# EAGLE design stm32uni (EAGLE 6.1)
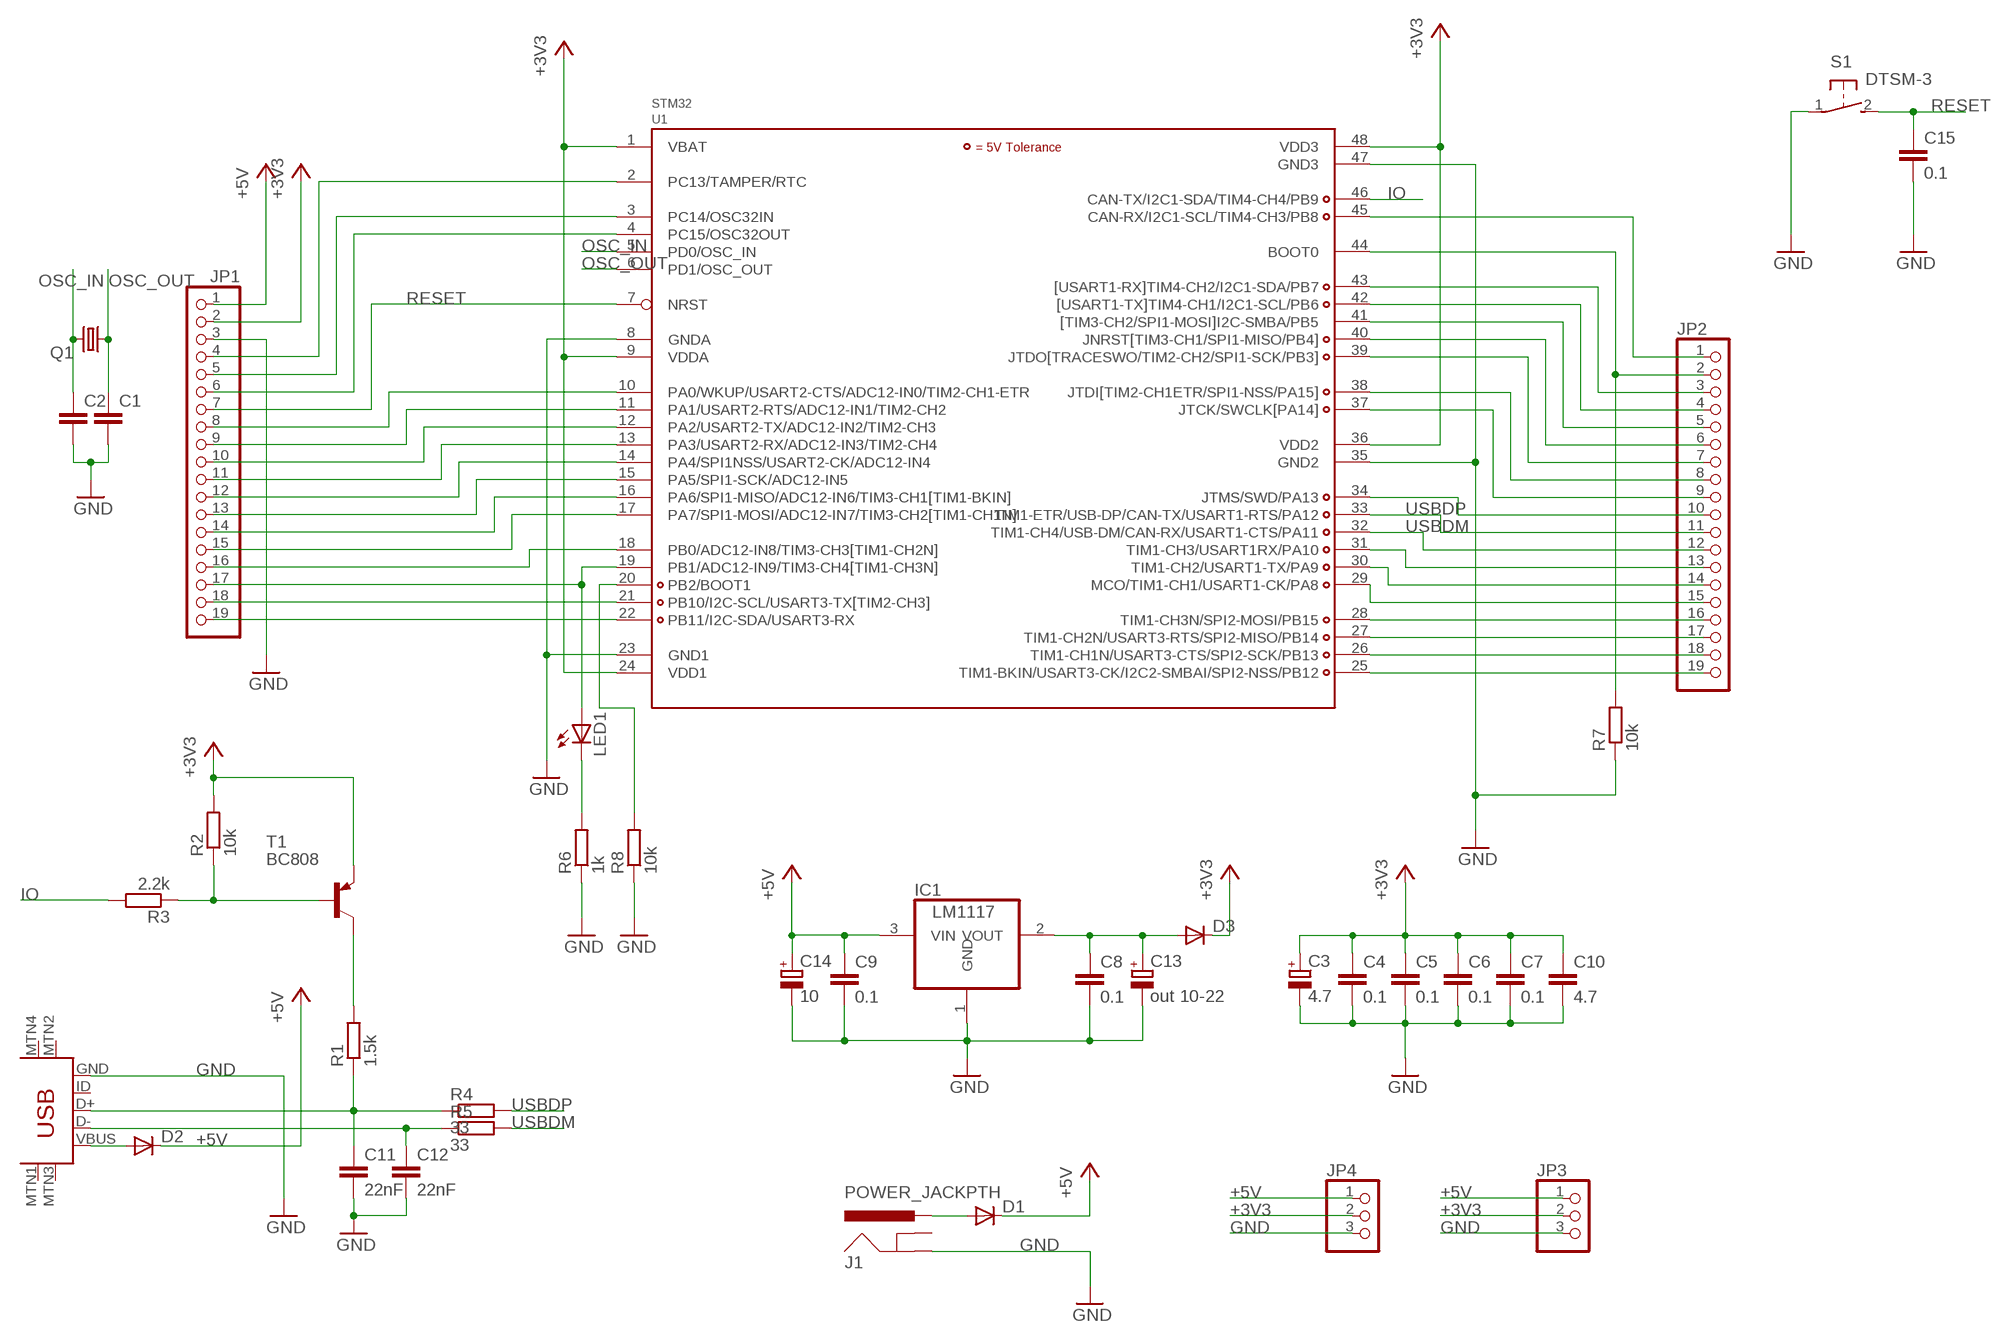
[diagram p0: schematic, sheet 1]

## Parts
C1  C-EUC0805  [C0805]
C2  C-EUC0805  [C0805]
C3  4.7  CPOL-EUSMCB  [SMC_B]
C4  0.1  C-EUC0805  [C0805]
C5  0.1  C-EUC0805  [C0805]
C6  0.1  C-EUC0805  [C0805]
C7  0.1  C-EUC0805  [C0805]
C8  0.1  C-EUC0805  [C0805]
C9  0.1  C-EUC0805  [C0805]
C10  4.7  C-EUC0805  [C0805]
C11  22nF  C-EUC0805  [C0805]
C12  22nF  C-EUC0805  [C0805]
C13  out 10-22  CPOL-EUSMCB  [SMC_B]
C14  10  CPOL-EUSMCB  [SMC_B]
C15  0.1  C-EUC0805  [C0805]
D1  DIODE-SOD123  [SOD123]
D2  DIODE-SOD123  [SOD123]
D3  DIODE-SOD123  [SOD123]
IC1  LM1117  REG1117  [SOT223]
J1  POWER_JACKPTH  [POWER_JACK_PTH]
JP1  PINHD-1X19  [1X19]
JP2  PINHD-1X19  [1X19]
JP3  PINHD-1X3  [1X03]
JP4  PINHD-1X3  [1X03]
LED1  LEDCHIPLED_0805  [CHIPLED_0805]
Q1  CRYSTALHC49UP  [HC49UP]
R1  1.5k  R-EU_R0805  [R0805]
R2  10k  R-EU_R0805  [R0805]
R3  2.2k  R-EU_R0805  [R0805]
R4  33  R-EU_R0805  [R0805]
R5  33  R-EU_R0805  [R0805]
R6  1k  R-EU_R0805  [R0805]
R7  10k  R-EU_R0805  [R0805]
R8  10k  R-EU_R0805  [R0805]
S1  DTSM-3  [DTSM-3]
T1  BC808  BC808-16-PNP-SOT23-BEC  [SOT23-BEC]
U1  STM32  STM32F103C8LQFP48  [LQFP48]
U$1  USB-MINIB-5PIN  [USB-MINIB]

## Nets
+3V3: C3.+ C4.1 C5.1 C6.1 C7.1 C10.1 D3.C JP1.2 JP3.2 JP4.2 R2.2 T1.E U1.1(VBAT) U1.9(VDDA) U1.24(VDD1) U1.36(VDD2) U1.48(VDD3)
+5V: C9.1 C14.+ D1.C D2.C IC1.3(VIN) JP1.1 JP3.1 JP4.1
GND: C1.2 C2.2 C3.- C4.2 C5.2 C6.2 C7.2 C8.2 C9.2 C10.2 C11.2 C12.2 C13.- C14.- C15.2 IC1.1(GND) J1.GND JP1.3 JP3.3 JP4.3 R6.1 R7.1 R8.1 S1.1 U1.8(GNDA) U1.23(GND1) U1.35(GND2) U1.47(GND3) U$1.GND
IO: R3.2 U1.46(CAN-TX/I2C1-SDA/TIM4-CH4/PB9)
N$1: D2.A U$1.VBUS
N$2: D1.A J1.PWR
N$3: C8.1 C13.+ D3.A IC1.2(VOUT)
N$4: JP1.16 U1.18(PB0/ADC12-IN8/TIM3-CH3[TIM1-CH2N])
N$5: JP1.15 U1.17(PA7/SPI1-MOSI/ADC12-IN7/TIM3-CH2[TIM1-CH1N])
N$6: C11.1 R1.1 R4.1 U$1.D+
N$7: C12.1 R5.1 U$1.D-
N$8: R1.2 T1.C
N$9: R2.1 R3.1 T1.B
N$10: JP2.19 U1.25(TIM1-BKIN/USART3-CK/I2C2-SMBAI/SPI2-NSS/PB12)
N$11: JP2.18 U1.26(TIM1-CH1N/USART3-CTS/SPI2-SCK/PB13)
N$12: JP2.17 U1.27(TIM1-CH2N/USART3-RTS/SPI2-MISO/PB14)
N$13: JP2.16 U1.28(TIM1-CH3N/SPI2-MOSI/PB15)
N$14: JP2.15 U1.29(MCO/TIM1-CH1/USART1-CK/PA8)
N$15: JP2.14 U1.30(TIM1-CH2/USART1-TX/PA9)
N$16: JP2.13 U1.31(TIM1-CH3/USART1RX/PA10)
N$17: JP2.10 U1.34(JTMS/SWD/PA13)
N$18: JP2.9 U1.37(JTCK/SWCLK[PA14])
N$19: JP2.8 U1.38(JTDI[TIM2-CH1ETR/SPI1-NSS/PA15])
N$20: JP2.7 U1.39(JTDO[TRACESWO/TIM2-CH2/SPI1-SCK/PB3])
N$21: JP2.6 U1.40(JNRST[TIM3-CH1/SPI1-MISO/PB4])
N$22: JP2.5 U1.41([TIM3-CH2/SPI1-MOSI]I2C-SMBA/PB5)
N$23: JP2.4 U1.42([USART1-TX]TIM4-CH1/I2C1-SCL/PB6)
N$24: JP2.3 U1.43([USART1-RX]TIM4-CH2/I2C1-SDA/PB7)
N$25: JP2.2 R7.2 U1.44(BOOT0)
N$26: JP2.1 U1.45(CAN-RX/I2C1-SCL/TIM4-CH3/PB8)
N$27: JP1.19 U1.22(PB11/I2C-SDA/USART3-RX)
N$28: JP1.18 U1.21(PB10/I2C-SCL/USART3-TX[TIM2-CH3])
N$29: R8.2 U1.20(PB2/BOOT1)
N$30: JP1.14 U1.16(PA6/SPI1-MISO/ADC12-IN6/TIM3-CH1[TIM1-BKIN])
N$31: JP1.13 U1.15(PA5/SPI1-SCK/ADC12-IN5)
N$32: JP1.12 U1.14(PA4/SPI1NSS/USART2-CK/ADC12-IN4)
N$33: JP1.11 U1.13(PA3/USART2-RX/ADC12-IN3/TIM2-CH4)
N$34: JP1.10 U1.12(PA2/USART2-TX/ADC12-IN2/TIM2-CH3)
N$35: JP1.9 U1.11(PA1/USART2-RTS/ADC12-IN1/TIM2-CH2)
N$36: JP1.8 U1.10(PA0/WKUP/USART2-CTS/ADC12-IN0/TIM2-CH1-ETR)
N$38: JP1.6 U1.4(PC15/OSC32OUT)
N$39: JP1.5 U1.3(PC14/OSC32IN)
N$40: JP1.4 U1.2(PC13/TAMPER/RTC)
N$41: JP1.17 LED1.A U1.19(PB1/ADC12-IN9/TIM3-CH4[TIM1-CH3N])
N$42: LED1.C R6.2
OSC_IN: C2.1 Q1.2 U1.5(PD0/OSC_IN)
OSC_OUT: C1.1 Q1.1 U1.6(PD1/OSC_OUT)
RESET: C15.1 JP1.7 S1.2 U1.7(NRST)
USBDM: JP2.12 R5.2 U1.32(TIM1-CH4/USB-DM/CAN-RX/USART1-CTS/PA11)
USBDP: JP2.11 R4.2 U1.33(TIM1-ETR/USB-DP/CAN-TX/USART1-RTS/PA12)
Unconnected: J1.GNDBREAK U$1.ID U$1.MTN1(MTN2) U$1.MTN2(MTN3) U$1.MTN3(MTN1) U$1.MTN4

## Library data of the parts
C1 C2 C4-C12 C15 = rcl:C-EU: CAPACITOR, European symbol
C3 C13 C14 = rcl:CPOL-EU: POLARIZED CAPACITOR, European symbol
D1-D3 = diode:DIODE-: DIODE
IC1 = burr-brown:REG1117: 800mA and 1A Low Dropout (LDO) Positive Regulator 1.8V, 2.5V, 2.85V, 3.3V, 5V, and Adj; MPN: REG1117; OC_FARNELL: 1097566; OC_NEWARK: 14P6981
J1 = SparkFun:POWER_JACK: Power Jack This is the standard 5.5mm barrel jack for power. The PTH is the most common, proven, reliable, footprint. All others are experimental. The Slot footprint only works if the mill layer is transmitted to the PCB fab house so be warned. Spark Fun Electronics SKU : PRT-00119. Mating wall wart : TOL-00298 (and others)
JP1 JP2 = pinhead:PINHD-1X19: PIN HEADER
JP3 JP4 = pinhead:PINHD-1X3: PIN HEADER
LED1 = led:LED: LED OSRAM: - CHIPLED LG R971, LG N971, LY N971, LG Q971, LY Q971, LO R971, LY R971 LH N974, LH R974 LS Q976, LO Q976, LY Q976 LO Q996 - Hyper CHIPLED LW Q18S LB Q993, LB Q99A, LB R99A - SideLED LS A670, LO A670, LY A670, LG A670, LP A670 LB A673, LV A673, LT A673, LW A673 LH A674 LY A675 LS A676, LA A676, LO A676, LY A676, LW A676 LS A679, LY A679, LG A679 - Hyper Micro SIDELED® LS Y876, LA Y876, LO Y876, LY Y876 LT Y87S - SmartLED LW L88C, LW L88S LB L89C, LB L89S, LG L890 LS L89K, LO L89K, LY L89K LS L896, LA L896, LO L896, LY L896 - TOPLED LS T670, LO T670, LY T670, LG T670, LP T670 LSG T670, LSP T670, LSY T670, LOP T670, LYG T670 LG T671, LOG T671, LSG T671 LB T673, LV T673, LT T673, LW T673 LH T674 LS T676, LA T676, LO T676, LY T676, LB T676, LH T676, LSB T676, LW T676 LB T67C, LV T67C, LT T67C, LS T67K, LO T67K, LY T67K, LW E67C LS E67B, LA E67B, LO E67B, LY E67B, LB E67C, LV E67C, LT E67C LW T67C LS T679, LY T679, LG T679 LS T770, LO T770, LY T770, LG T770, LP T770 LB T773, LV T773, LT T773, LW T773 LH T774 LS E675, LA E675, LY E675, LS T675 LS T776, LA T776, LO T776, LY T776, LB T776 LHGB T686 LT T68C, LB T68C - Hyper Mini TOPLED® LB M676 - Mini TOPLED Santana® LG M470 LS M47K, LO M47K, LY M47K Source: http://www.osram.convergy.de LUXEON: - LUMILED® LXK2-PW12-R00, LXK2-PW12-S00, LXK2-PW14-U00, LXK2-PW14-V00 LXK2-PM12-R00, LXK2-PM12-S00, LXK2-PM14-U00 LXK2-PE12-Q00, LXK2-PE12-R00, LXK2-PE12-S00, LXK2-PE14-T00, LXK2-PE14-U00 LXK2-PB12-K00, LXK2-PB12-L00, LXK2-PB12-M00, LXK2-PB14-N00, LXK2-PB14-P00, LXK2-PB14-Q00 LXK2-PR12-L00, LXK2-PR12-M00, LXK2-PR14-Q00, LXK2-PR14-R00 LXK2-PD12-Q00, LXK2-PD12-R00, LXK2-PD12-S00 LXK2-PH12-R00, LXK2-PH12-S00 LXK2-PL12-P00, LXK2-PL12-Q00, LXK2-PL12-R00 Source: www.luxeon.com KINGBRIGHT: KA-3528ASYC Source: www.kingbright.com
Q1 = crystal:CRYSTAL: CRYSTAL; OC_FARNELL: unknown; OC_NEWARK: unknown
R1-R8 = rcl:R-EU_: RESISTOR, European symbol
S1 = switch-tact:DTSM-3
T1 = transistor:*-PNP-: PNP Transistror
U1 = stm32:STM32F103C8
U$1 = SparkFun:USB-MINIB: Mini-USB "B" connector with 5th pin broken out. Created new symbol breaking out 5th "ID" pin in mini/micro USB connector spec. See: http://en.wikipedia.org/wiki/Mini_usb#Cables. Uses same footprint as 4-pin symbol. Also added pins to connect to mounting / shield pads if required (probably not generally needed as signals aren't shielded once they leave the connector).

## Board
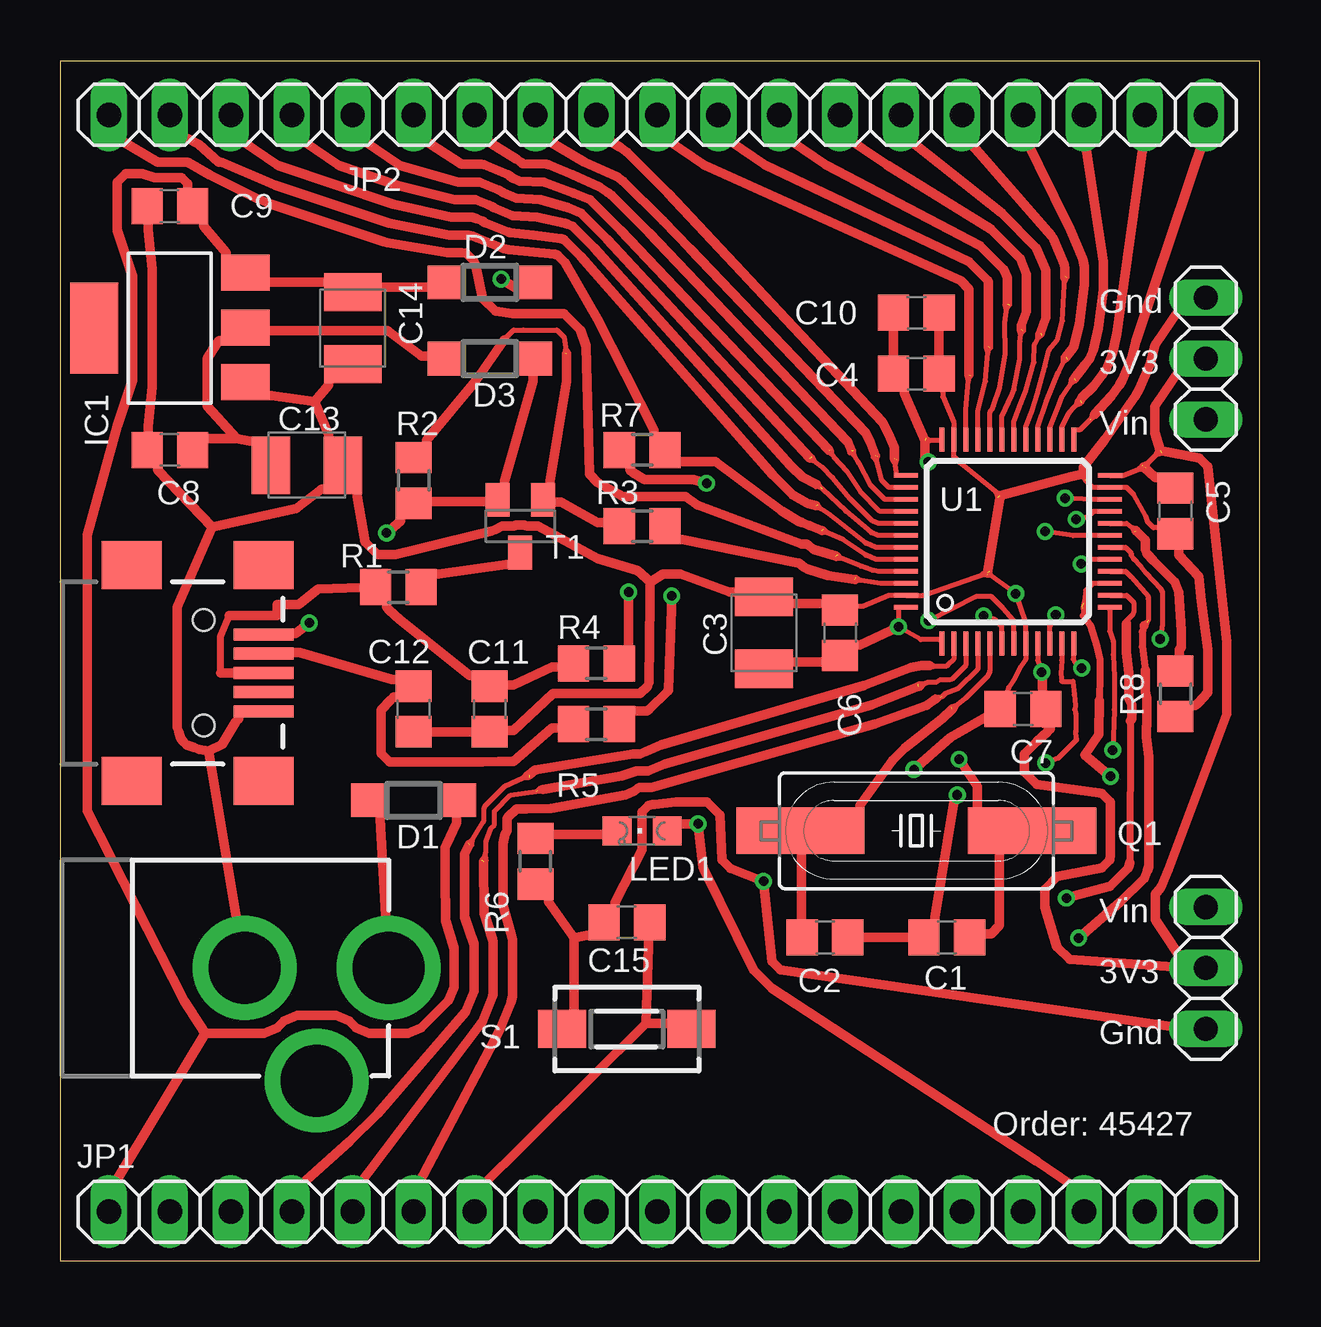
[diagram p1: board, top side]
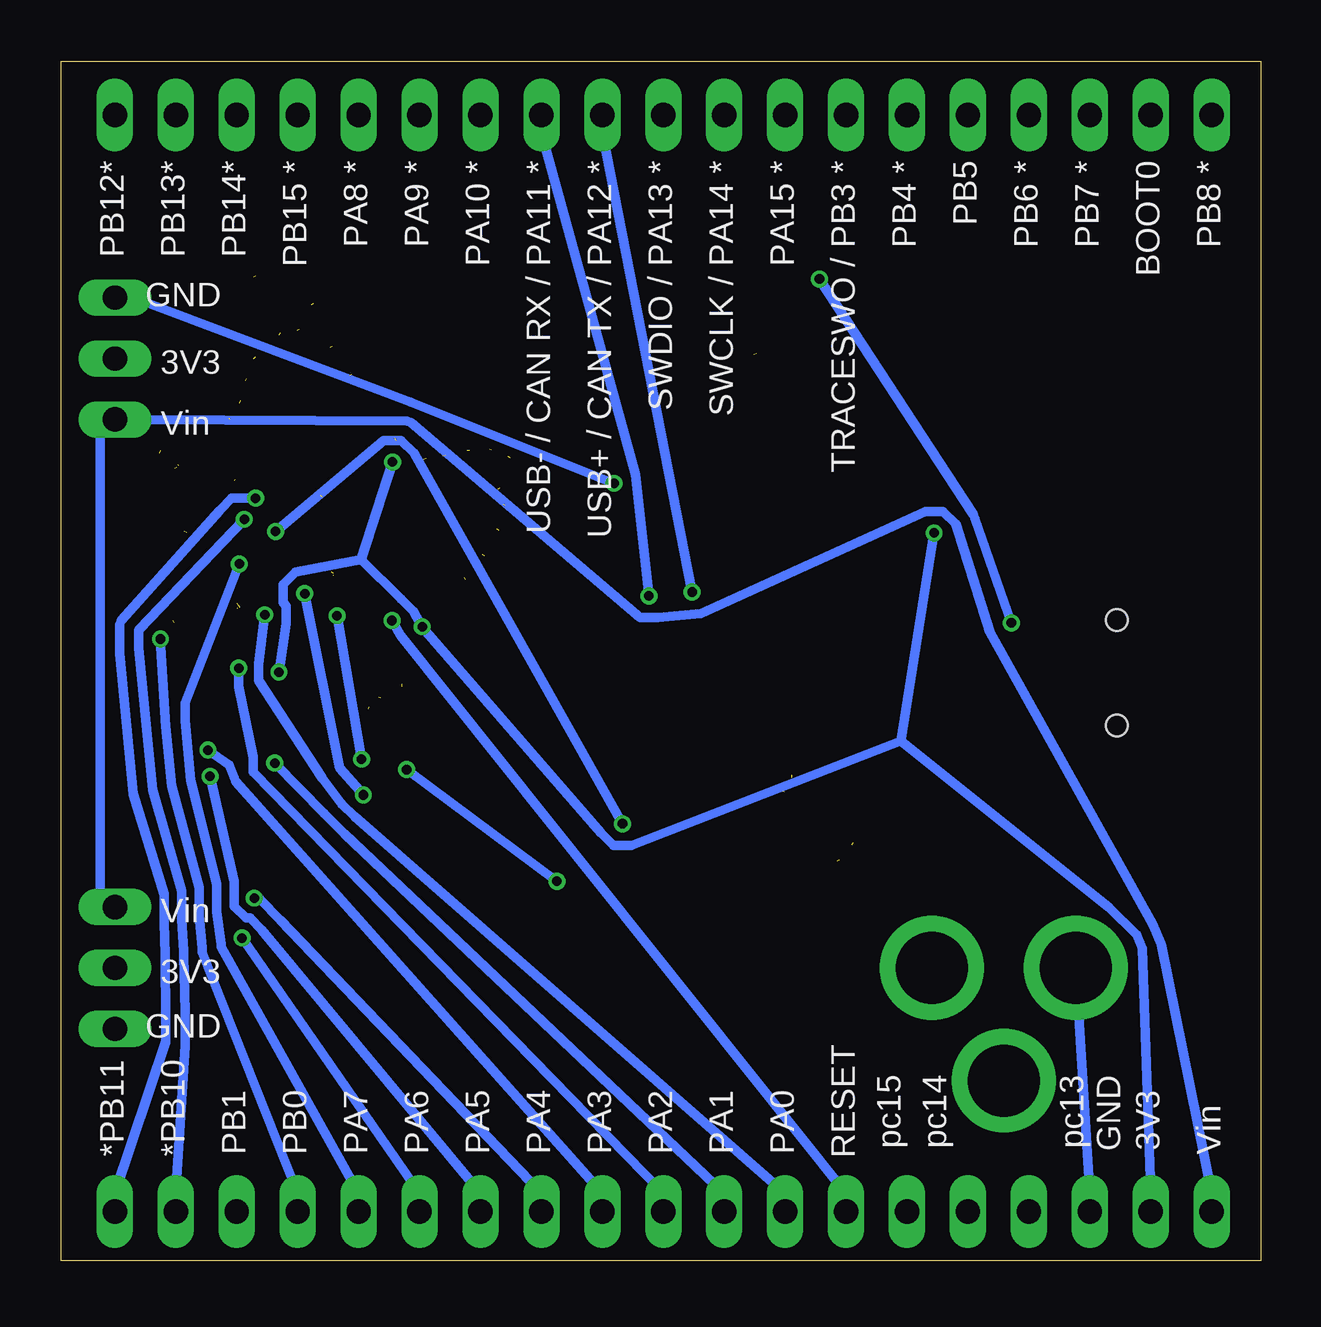
[diagram p2: board, bottom side, seen from below]

Size 50 x 50 mm. Coordinates in mm from the lower left corner, seen from the top.
Outline: 0,0 50,0 50,50 0,50 0,0
Copper layers (1*16): Top 0.035mm / dielectric 1.5mm / Bottom 0.035mm
Design rules: minimum track width 6mil, minimum drill 12mil, track to track 6mil, track to pad 6mil, pad to pad 6mil, via to via 6mil, smd to smd 0mil, copper to edge 10mil, drill to drill 10mil, minimum pad ring 10mil, minimum via ring 6mil, stop-mask expansion 2mil, vias tented up to drill 100mil, thermal gap 10mil

### Footprints (pad centres in the part's own frame; a part is rotated, then mirrored left to right if it is on the bottom)
C0805 = smd 1.3 x 1.5: 1 -0.95,0; 2 0.95,0
SMC_B = smd 1.6 x 2.4: + -1.5,0; - 1.5,0
SOD123 = smd 1.4 x 1.4: A 1.9,0; C -1.9,0
SOT223 = smd 1.499 x 2.007: 1 -2.261,-3.15; 2 0.025,-3.15; 3 2.311,-3.15 | smd 3.81 x 2.007: 4 0,3.15
POWER_JACK_PTH = drill 2.997 pad 4.318: GND 0,7.7; GNDBREAK 4.7,10.7; PWR 0,13.7
1X19 = drill 1.016 long: 1 -22.86,0; 2 -20.32,0; 3 -17.78,0; 4 -15.24,0; 5 -12.7,0; 6 -10.16,0; 7 -7.62,0; 8 -5.08,0; 9 -2.54,0; 10 0,0; 11 2.54,0; 12 5.08,0; 13 7.62,0; 14 10.16,0; 15 12.7,0; 16 15.24,0; 17 17.78,0; 18 20.32,0; 19 22.86,0
1X03 = drill 1.016 long: 1 -2.54,0; 2 0,0; 3 2.54,0
CHIPLED_0805 = smd 1.2 x 1.2: A 0,-1.05; C 0,1.05
HC49UP = smd 5.334 x 1.93: 1 -4.826,0; 2 4.826,0
R0805 = smd 1.3 x 1.5: 1 -0.95,0; 2 0.95,0
DTSM-3 = smd 2 x 1.6: 1 -2.7,0; 2 2.7,0
SOT23-BEC = smd 1 x 1.4: B -0.95,-1.1; C 0,1.1; E 0.95,-1.1
LQFP48 = smd 0.2 x 1: 1 -2.75,-4.25; 2 -2.25,-4.25; 3 -1.75,-4.25; 4 -1.25,-4.25; 5 -0.75,-4.25; 6 -0.25,-4.25; 7 0.25,-4.25; 8 0.75,-4.25; 9 1.25,-4.25; 10 1.75,-4.25; 11 2.25,-4.25; 12 2.75,-4.25; 25 2.75,4.25; 26 2.25,4.25; 27 1.75,4.25; 28 1.25,4.25; 29 0.75,4.25; 30 0.25,4.25; 31 -0.25,4.25; 32 -0.75,4.25; 33 -1.25,4.25; 34 -1.75,4.25; 35 -2.25,4.25; 36 -2.75,4.25 | smd 1 x 0.2: 13 4.25,-2.75; 14 4.25,-2.25; 15 4.25,-1.75; 16 4.25,-1.25; 17 4.25,-0.75; 18 4.25,-0.25; 19 4.25,0.25; 20 4.25,0.75; 21 4.25,1.25; 22 4.25,1.75; 23 4.25,2.25; 24 4.25,2.75; 37 -4.25,2.75; 38 -4.25,2.25; 39 -4.25,1.75; 40 -4.25,1.25; 41 -4.25,0.75; 42 -4.25,0.25; 43 -4.25,-0.25; 44 -4.25,-0.75; 45 -4.25,-1.25; 46 -4.25,-1.75; 47 -4.25,-2.25; 48 -4.25,-2.75
USB-MINIB = smd 2.5 x 0.5: D+ 2.5,0; D- 2.5,0.8; GND 2.5,-1.6; ID 2.5,-0.8; VBUS 2.5,1.6 | smd 2.5 x 2: MTN1 -3,4.5; MTN2 2.5,4.5; MTN3 -3,-4.5; MTN4 2.5,-4.5 | hole 0.9: 0,2.2; 0,-2.2

### Placement (x,y rotation side)
C1  36.97,13.47 180 top
C2  31.88,13.47 0 top
C3  29.34,26.17 90 top
C4  35.7,36.97 0 top
C5  46.49,31.25 270 top
C6  32.52,26.17 90 top
C7  40.14,23 180 top
C8  4.58,33.79 180 top
C9  4.58,43.95 180 top
C10  35.7,39.51 0 top
C11  17.91,23 270 top
C12  14.74,23 270 top
C13  10.29,33.16 0 top
C14  12.2,38.87 270 top
C15  23.63,14.11 180 top
D1  14.74,19.18 180 top
D2  17.91,40.77 0 top
D3  17.91,37.6 180 top
IC1  4.58,38.87 90 top
J1  0,12.2 270 top
JP1  24.9,2.04 0 top
JP2  24.9,47.76 0 top
JP3  47.76,12.2 270 top
JP4  47.76,37.6 90 top
LED1  24.27,17.91 90 top
Q1  35.7,17.91 180 top
R1  14.11,28.07 0 top
R2  14.74,32.52 270 top
R3  24.27,30.61 0 top
R4  22.36,24.9 0 top
R5  22.36,22.36 0 top
R6  19.82,16.64 90 top
R7  24.27,33.79 0 top
R8  46.49,23.63 90 top
S1  23.63,9.66 0 top
T1  19.18,30.61 180 top
U1  39.51,29.98 0 top
U$1  5.99,24.5 0 top

### Tracks (layer width: path | path; a pad name or v marks a point on that pad's centre or on a via)
+3V3  (via drill 0.4 pad 0.6)  (4 unrouted)
  Top 0.2: 45.15,33.16 45.35,33.24 45.27,33.03 | 45.91,33.67 45.7,33.59 45.78,33.8 | 36.09,34.28 36.29,34.19 36.09,34.1 | 45.17,32.97 44.96,32.98 45.11,33.14 | 45.87,33.76 45.18,33.07 44.3,32.73 44.26,32.73 44.16,32.73 U1.24 | U1.48 34.95,27.23 34.95,27.13 v34.95,26.42 35.88,25.88 36.66,25.88 36.76,25.88 U1.1 | U1.36 36.76,34.19 36.66,34.19 36.05,34.19 | U1.9 40.76,25.33 40.76,25.23 40.76,25.02 v40.92,24.53
  Top 0.4: 45.18,33.07 45.66,32.65 45.74,32.65 45.94,32.65 C5.1 | 47,12.2 45.67,14.17 45.66,14.2 45.66,15.28 45.67,15.31 45.85,15.49 45.92,15.64 46.19,16.28 48.64,22.78 48.64,23.88 48.64,25.78 47.84,33.1 47.49,33.45 45.87,33.76 45.64,34.52 45.64,35.6 45.65,35.64 47,37.6 JP4.2 | 47,12.2 JP3.2 47,12.2 | v34.95,26.42 33.35,25.67 33.27,25.67 33.07,25.67 C6.1 31.97,24.95 31.77,24.95 30.55,24.95 30.34,24.95 C3.+ | v36.19,33.29 36.05,33.48 36.05,34.19 35.2,36.13 35.2,36.22 35.2,36.41 C4.1 34.74,37.52 34.74,37.72 34.74,38.76 34.74,38.95 C10.1 | v13.61,30.33 14.07,30.72 14.19,30.84 14.19,30.92 14.19,31.12 R2.2 15.29,31.64 15.49,31.64 17.73,31.64 17.93,31.64 T1.E 18.54,32.22 18.54,32.41 18.54,32.5 19.71,36.65 19.71,36.9 19.71,37.1 D3.C | 47,12.2 42.09,12.55 41.56,13.08 41.05,14.74 41.05,15.48 41.58,16.01 43.43,16.37 43.77,16.71 43.79,16.9 43.79,17.4 43.79,19.13 43.44,19.48 43.32,19.49 40.72,19.84 40.19,20.37 40.19,21.11 40.72,21.64 41.16,22.05 41.27,22.16 41.27,22.25 40.92,22.45 C7.1 41.08,23.09 40.88,23.14 40.98,23.53 v40.92,24.53
  Bottom 0.4: 14.99,21.67 26.23,17.31 26.97,17.31 27.5,17.84 v34.95,26.42 35.31,27.05 35.84,27.58 37.49,29.23 | 14.99,21.67 v13.61,30.33 | v40.92,24.53 40.61,26.55 40.61,27.29 40.74,27.43 40.74,28.17 40.21,28.7 37.49,29.23 | v36.19,33.29 37.49,29.23 | JP1.2 4.58,2.8 4.94,13.02 5.17,13.57 6.33,14.73 14.99,21.67
+5V
  Top 0.4: 6.06,9.47 5.17,10.83 1.14,18.75 1.14,19.25 1.14,30.25 2.38,34.79 3.03,36.72 3.03,37.21 3.03,41.02 2.38,42.95 2.38,43.45 2.38,44.95 2.73,45.3 3.23,45.3 3.43,45.3 3.94,45.15 5.06,45.15 5.33,44.88 5.33,44.7 5.33,44.5 C9.1 5.98,43.4 5.98,43.2 5.98,43.12 6.93,42.01 6.93,41.93 6.93,41.73 IC1.3 8.53,40.78 8.73,40.78 11,40.78 11.2,40.78 C14.+ 13.2,40.57 13.4,40.57 15.31,40.57 15.52,40.57 D2.C | 6.06,9.47 8.51,9.48 9.05,9.7 9.35,10 9.89,10.22 11.51,10.22 12.05,10 12.35,9.7 12.89,9.48 14.51,9.48 15.05,9.7 16.2,10.85 16.42,11.39 16.42,13.01 16.07,14.18 16.06,16.04 16.06,17.22 16.11,17.34 16.53,18.24 16.53,18.48 16.53,18.68 D1.C | JP1.1 2.04,2.8 6.06,9.47
  Bottom 0.4: JP3.1 48.36,14.74 48.36,35.06 JP4.1 47,35.06 35.58,34.99 35.42,34.92 25.87,26.81 25.13,26.81 23.33,26.97 13.98,31.23 13.24,31.23 12.71,30.7 11.29,26.21 4.49,14.02 4.14,13.18 2.04,2.8 JP1.1
GND  (via drill 0.4 pad 0.6)  (4 unrouted)
  Top 0.2: 39.1,31.84 39.01,32.03 39.22,31.98 | 38.75,28.72 38.85,28.53 38.64,28.57 | 38.65,28.57 38.43,28.59 38.59,28.74 | 42.74,32.78 42.74,32.56 42.57,32.7 | 39.19,31.88 37.55,33.23 37.26,33.52 37.26,33.73 37.26,33.83 U1.35 37.26,34.63 37.26,34.73 37.26,34.94 36.8,36.01 36.8,36.22 36.8,36.31 C4.2 | C6.2 33.17,27.27 33.27,27.27 33.48,27.27 34.55,27.73 34.76,27.73 34.85,27.73 U1.47 35.66,27.73 35.76,27.73 35.96,27.73 38.66,28.67 v39.84,27.8 40.26,26.6 40.26,26.23 40.26,26.13 U1.8 40.26,25.33 40.26,25.23 40.26,25.06 40.05,24.76 39.75,24.2 39.55,23.89 C7.2 | 42.64,32.78 42.76,32.52 43.05,32.23 43.26,32.23 43.35,32.23 U1.23 44.16,32.23 44.26,32.23 44.46,32.23 44.76,31.94 45.26,31.04 45.34,30.79 45.58,30.55 45.74,30.55 45.84,30.55 C5.2
  Top 0.4: 38.66,28.67 39.19,31.88 42.16,32.68 42.64,32.78 42.66,33.08 43.55,34.23 44.83,36.04 44.99,36.32 45.44,37.4 45.64,38.14 45.65,38.18 47,40.14 JP4.3 | 6.2,21.24 5.8,21.3 5.59,21.38 5.28,21.5 5.16,21.62 5.02,21.75 4.94,22.06 4.89,22.23 4.89,27.24 6.35,30.57 | 6.2,21.24 6.77,21.52 7.32,22.45 7.44,22.57 7.44,22.65 7.44,22.85 U$1.GND | 24.62,28.28 24.6,28.08 24.6,27.5 24.56,24.1 24.48,23.93 24.18,23.63 20.55,23.63 18.91,22.09 18.66,22.09 18.46,22.09 C11.2 17.36,22.05 17.16,22.05 15.49,22.05 15.29,22.05 C12.2 | 10.61,35.8 11.2,34.44 11.2,34.35 11.2,34.16 C13.- | v26.95,32.4 26.41,32.55 24.36,32.55 23.88,32.84 23.77,32.96 23.77,33.04 23.77,33.24 R7.1 | S1.1 21.43,10.26 21.43,10.46 21.43,13.46 | R6.1 20.37,15.24 20.37,15.04 20.37,14.96 21.43,13.46 | JP3.3 47,9.66 30.04,12.12 29.68,12.47 v29.33,15.81 27.95,16.35 27.6,16.7 27.5,18.58 26.97,19.11 26.23,19.11 25.67,19.11 24.79,19.01 24.71,19.01 24.53,18.96 24.27,18.7 24.27,17.13 23.13,14.94 23.13,14.86 23.13,14.65 C15.2 22.23,13.55 22.03,13.55 21.95,13.55 21.43,13.46 | J1.GND 6.2,21.24 | IC1.1 8.53,36.06 8.73,36.06 8.82,36.06 10.61,35.8 | C14.- 11.2,36.77 11.2,36.57 11.2,36.49 10.61,35.8 | C13.- 11.2,32.16 10.99,32.16 10.91,32.16 9.84,31.36 6.35,30.57 | C13.- 12.39,32.16 12.39,31.95 12.39,31.87 12.71,29.96 13.24,29.43 13.98,29.43 17.98,30.41 18.16,30.47 18.44,30.61 18.9,30.61 18.98,30.63 19,30.66 19.37,30.66 19.39,30.63 19.47,30.61 19.93,30.61 22.42,29.27 24.07,28.77 24.62,28.28 | C10.2 36.65,38.95 36.65,38.76 36.65,37.72 36.65,37.52 C4.2 | 6.35,30.57 4.08,32.96 4.08,33.04 4.08,33.24 C8.2 3.68,34.34 3.68,34.54 3.68,34.79 3.83,36.41 3.83,37.52 3.83,41.33 3.68,42.95 3.68,43.2 3.68,43.4 C9.2
  Top 0.4: C7.2 39.38,22.84 39.17,22.84 38.93,22.84 37.11,21.8 v35.6,20.47 | C5.2 46.64,29.85 46.64,29.65 46.64,29.4 47.48,28.51 47.58,27.5 47.69,26.56 47.84,25.48 47.84,24.18 47.84,23.68 47.44,23.25 47.32,23.13 47.24,23.13 47.04,23.13 R8.1 | 24.62,28.28 25.13,28.61 25.87,28.61 27.9,27.87 28.14,27.87 28.34,27.87 C3.- 30.34,27.39 30.55,27.39 31.77,27.39 31.97,27.39 C6.2 | C2.2 33.28,13.47 33.48,13.47 35.37,13.47 35.56,13.47 C1.2 36.47,14.02 36.47,14.22 36.47,14.3 37.25,19.13 v37.4,19.41
  Bottom 0.4: v35.6,20.47 v29.33,15.81 | v39.84,27.8 38.38,20.53 v37.4,19.41 | JP4.3 47,40.14 35.42,35.79 v26.95,32.4 | JP1.3 7.12,2.8 J1.GND
IO  (1 unrouted)
  Top 0.2: 33.19,28.48 33.37,28.36 33.16,28.3 | U1.46 34.85,28.23 34.76,28.23 34.2,28.23 33.13,28.4
  Top 0.4: 33.13,28.4 32.02,28.56 31.16,28.83 31.04,28.88 30.79,29.07 30.75,29.07 25.95,30.07 25.86,30.07 25.66,30.07 R3.2
N$1  (via drill 0.4 pad 0.6)
  Top 0.2: 19.11,40.48 19.21,40.48 D2.A
  Top 0.4: v18.39,40.92 19.11,40.48 | U$1.VBUS 9.54,26.15 9.74,26.15 9.82,26.15 v10.39,26.58
  Bottom 0.4: v10.39,26.58 11.91,30.94 11.98,31.1 v18.39,40.92
N$2
  Top 0.4: J1.PWR 13.34,18.4 13.34,18.48 13.34,18.68 D1.A
N$3
  Top 0.4: 7.36,34.27 7.91,34.16 7.99,34.16 8.2,34.16 C13.+ | 7.36,34.27 6.13,35.61 6.13,36.11 6.13,37.61 6.53,38.23 6.64,38.35 6.73,38.35 6.93,38.35 IC1.2 8.53,38.77 8.73,38.77 13.65,38.77 15.07,37.7 15.31,37.7 15.52,37.7 D3.A | C8.1 5.98,34.27 6.18,34.27 7.36,34.27
N$4  (via drill 0.4 pad 0.6)
  Top 0.2: U1.18 44.16,29.73 44.26,29.73 44.32,29.73 44.42,29.73 44.65,29.49 44.65,29.4 44.75,29.24 45.04,28.95 45.27,28.65 45.89,28 45.95,27.84 45.95,27.74 45.95,26.52 v45.86,25.91
  Bottom 0.4: v45.86,25.91 45.63,22.27 45.39,19.78 44.24,15.56 44.24,14.38 44.11,13.05 44.11,12.85 40.14,2.8 JP1.16
N$5  (via drill 0.4 pad 0.6)
  Top 0.2: U1.17 43.35,29.23 43.26,29.23 42.8,29.23 v42.57,29.04
  Bottom 0.4: v42.57,29.04 44.83,23.25 44.83,22.51 44.59,20.02 43.51,15.7 43.51,14.53 43.34,13.2 43.34,13.09 37.6,2.8 JP1.15
N$6
  Top 0.3: 6.7,24.5 6.7,26.05 7.05,26.9
  Top 0.4: R4.1 20.96,24.75 20.76,24.75 20.51,24.75 18.91,24 18.66,24 18.46,24 C11.1 17.36,24.39 17.16,24.39 17.08,24.39 14.16,26.73 13.72,27.12 13.61,27.24 13.61,27.32 13.61,27.52 R1.1 10.75,28 9.95,27.35 9.05,27.35 9.05,26.9 7.05,26.9 | U$1.D+ 6.7,24.5
N$7
  Top 0.4: U$1.D- 9.54,25.35 9.74,25.35 9.99,25.35 13.84,24.22 13.99,24.22 14.19,24.22 C12.1 14.19,23.5 13.99,23.5 13.91,23.5 13.79,23.38 13.39,22.94 13.39,21.64 13.39,21.15 13.74,20.8 17.12,20.8 17.61,20.8 18.29,20.8 18.91,20.8 20.51,22.21 20.76,22.21 20.96,22.21 R5.1
N$8
  Top 0.4: T1.C 18.89,29.02 18.68,29.02 18.6,29.02 15.79,28.62 15.7,28.62 15.5,28.62 R1.2
N$9  (1 unrouted)
  Top 0.2: 18.62,38.5 18.48,38.45 | 18.62,38.5 18.61,38.35 | 21.02,37.82 21.08,38.03 21.2,37.84 | 18.51,38.36 18.62,38.5 | 18.62,38.5 18.91,38.79 19.32,38.79 20.72,38.79 21.01,38.5 21.12,37.79
  Top 0.4: 21.12,37.79 21.11,36.65 20.43,32.5 20.43,32.41 20.43,32.22 T1.B 20.43,31.62 20.64,31.62 20.88,31.62 22.42,30.77 22.66,30.77 22.86,30.77 R3.1 | R2.1 15.29,33.92 15.29,34.12 15.29,34.2 17.32,36.65 18.51,38.36
N$10  (1 unrouted)
  Top 0.2: 43.19,35.2 42.99,35.1 43.04,35.31 | U1.25 42.26,34.63 42.35,34.63 42.4,34.63 42.54,34.64 42.95,35.05 43.14,35.29
  Top 0.4: 43.14,35.29 43.83,36.05 44.15,36.49 44.28,36.7 44.67,37.63 44.84,38.3 45.64,40.68 47.76,47 JP2.19
N$11  (1 unrouted)
  Top 0.2: 42.57,35.75 42.37,35.66 42.44,35.87 | U1.26 41.76,34.63 41.76,34.73 42.06,35.32 42.53,35.84
  Top 0.4: 42.53,35.84 42.6,35.98 43.08,36.43 43.47,36.95 43.6,37.15 43.87,37.79 44.04,38.63 44.08,38.79 44.29,40.29 45.22,47 JP2.18
N$12  (1 unrouted)
  Top 0.2: 42.33,36.67 42.14,36.56 42.18,36.78 | U1.27 41.26,34.63 41.26,34.73 41.59,35.55 41.75,35.99 42.28,36.76
  Top 0.4: 42.28,36.76 42.72,37.33 42.93,37.61 43.07,37.95 43.28,38.87 43.49,40.45 43.49,41.63 42.68,47 JP2.17
N$13  (1 unrouted)
  Top 0.2: 41.98,37.58 41.81,37.44 41.82,37.66 | U1.28 40.76,34.63 40.76,34.73 40.76,34.77 41.11,35.81 41.62,37.03 41.92,37.66
  Top 0.4: 41.92,37.66 42.25,38.06 42.27,38.11 42.48,39.02 42.69,40.71 42.69,41.37 42.69,41.44 42.63,41.75 42.12,42.97 40.14,47 JP2.16
N$14  (1 unrouted)
  Top 0.2: 41.98,40.99 41.88,40.8 41.8,41 | U1.29 40.26,34.63 40.26,34.73 40.26,34.77 40.52,35.46 40.74,36.11 41.06,37.27 41.22,37.95 41.57,38.37 41.78,39.16 41.89,41.04
  Top 0.4: 41.89,41.04 41.89,41.36 41.86,41.52 41.41,42.59 41.32,42.72 37.6,47 JP2.15
N$15  (1 unrouted)
  Top 0.2: 40.93,38.58 40.76,38.45 40.77,38.67 | U1.30 39.76,34.63 39.76,34.73 39.76,34.98 40.05,35.75 40.26,36.27 40.6,37.45 40.62,38.19 40.63,38.2 40.87,38.66
  Top 0.4: 40.87,38.66 41.09,39.3 41.09,40.48 41.09,41.28 41.08,41.28 40.7,42.21 39.25,43.66 35.06,47 JP2.14
N$16  (1 unrouted)
  Top 0.2: 40.16,38.76 40.05,38.57 39.98,38.78 | U1.31 39.26,34.63 39.26,34.73 39.26,35.19 39.67,36.07 39.76,36.3 40,37.57 40.02,38.31 40.08,38.81
  Top 0.4: 40.08,38.81 40.08,38.99 40.29,39.56 40.29,40.22 40.29,41.12 40.02,41.76 38.8,42.98 34.48,45.65 32.52,47 JP2.13
N$17  (1 unrouted)
  Top 0.2: 37.98,36.89 37.87,36.7 37.8,36.91 | U1.34 37.76,34.63 37.76,34.73 37.76,35.48 37.89,36.94
  Top 0.4: 37.89,36.94 37.9,37.27 37.9,37.76 37.89,38.1 37.89,39.52 37.89,40.01 37.89,40.5 37.54,40.85 26.86,45.65 24.9,47 JP2.10
N$18  (1 unrouted)
  Top 0.2: 34.88,33.4 34.82,33.19 34.7,33.38 | U1.37 34.85,32.73 34.85,32.83 34.85,32.87 34.79,33.43
  Top 0.4: 34.79,33.43 34.78,33.88 34.53,34.47 34.28,34.95 25.35,44.5 23.64,46.21 23.34,46.41 22.36,47 JP2.9
N$19  (1 unrouted)
  Top 0.2: 34.08,33.53 34.04,33.32 33.9,33.49 | U1.38 34.85,32.23 34.76,32.23 34.55,32.23 34.26,32.52 33.98,33.55
  Top 0.4: 33.98,33.55 33.78,34.09 33.6,34.49 26.26,42.17 25.13,43.34 23.47,45 23.21,45.18 21.86,45.79 19.82,47 JP2.8
N$20  (1 unrouted)
  Top 0.2: 33.08,33.77 33.1,33.55 32.92,33.68 | U1.39 34.85,31.73 34.76,31.73 34.38,31.73 34.35,31.76 33.78,32.33 33.3,33.24 33.28,33.26 32.98,33.76
  Top 0.4: 32.98,33.76 32.85,34.11 32.8,34.16 24.55,42.86 22.99,44.42 22.85,44.51 22.46,44.76 21.38,45.27 20.37,45.68 20.28,45.7 19.29,45.72 19.22,45.79 19.02,45.92 17.28,47 JP2.7
N$21  (1 unrouted)
  Top 0.2: 32.15,33.8 32.19,33.59 32,33.69 | U1.40 34.85,31.23 34.76,31.23 34.2,31.23 34.15,31.25 33.38,32.03 32.8,32.9 32.28,33.47 32.05,33.78
  Top 0.4: 32.05,33.78 23.36,42.95 22.09,44.22 21.41,44.5 20.18,44.96 19.15,45 18.88,45.11 18.87,45.12 18.75,45.22 18.67,45.27 17.67,45.68 17.58,45.7 16.75,45.7 16.74,45.7 14.74,47 JP2.6
N$22  (1 unrouted)
  Top 0.2: 31.36,33.51 31.46,33.31 31.25,33.36 | U1.41 34.85,30.73 34.76,30.73 34.11,30.73 33.87,30.83 32.95,31.75 32.21,32.65 31.8,33.06 31.76,33.08 31.27,33.46
  Top 0.4: 31.27,33.46 22.81,42.59 21.73,43.67 21.28,43.85 21.17,43.89 20.03,44.22 19.01,44.28 18.47,44.51 18.44,44.54 18.3,44.62 17.48,44.96 16.6,44.96 14.2,45.64 14.16,45.65 12.2,47 JP2.5
N$23  (1 unrouted)
  Top 0.2: 31.6,32.41 31.71,32.23 31.49,32.26 | U1.42 34.85,30.23 34.76,30.23 34.09,30.23 33.81,30.34 32.76,31.24 31.79,32.17 31.51,32.36
  Top 0.4: 31.51,32.36 30.94,32.66 30.47,33.13 22.26,42.22 21.36,43.12 21.15,43.21 21.04,43.24 19.89,43.49 18.87,43.57 18.07,43.9 18.04,43.93 17.88,44 17.33,44.22 16.46,44.22 14.04,44.84 11.66,45.64 11.62,45.65 9.66,47 JP2.4
N$24  (1 unrouted)
  Top 0.2: 31.58,31.52 31.7,31.34 31.49,31.37 | U1.43 34.85,29.73 34.76,29.73 34.01,29.73 33.59,29.9 32.04,31.13 31.5,31.47
  Top 0.4: 31.5,31.47 31.18,31.56 30.55,31.91 29.72,32.74 21.7,41.87 21.01,42.56 20.88,42.6 19.74,42.75 18.76,42.85 18.69,42.86 17.7,43.27 17.64,43.31 17.63,43.32 17.38,43.43 17.19,43.49 16.31,43.49 13.88,44.04 9.12,45.64 9.08,45.65 7.12,47 JP2.3
N$25  (1 unrouted)
  Top 0.2: 31.82,30.5 31.97,30.34 31.75,30.33 | U1.44 34.85,29.23 34.76,29.23 34.01,29.23 33.59,29.4 32.64,30.06 31.75,30.43
  Top 0.4: 31.75,30.43 31.25,30.63 30.92,30.76 30.8,30.81 30.1,31.23 27.32,33.3 25.86,33.3 25.66,33.3 R7.2 24.77,34.34 24.77,34.54 24.77,34.62 22.4,39.24 21.05,41.6 20.74,41.91 20.61,41.95 18.69,42.13 18.48,42.17 17.36,42.64 17.23,42.71 17.04,42.75 16.21,42.75 13.72,43.24 11.34,44.04 8.96,44.84 8.63,44.97 6.78,45.76 6.71,45.79 6.62,45.79 5.78,46.53 5.33,46.76 4.99,46.9 4.58,47 JP2.2
N$26  (1 unrouted)
  Top 0.2: 32.42,29.43 32.57,29.27 32.35,29.26 | U1.45 34.85,28.73 34.76,28.73 34.11,28.73 33.85,28.78 33.38,28.95 32.35,29.36
  Top 0.4: 32.35,29.36 31.42,29.63 31.15,29.85 31.09,29.87 30.91,29.87 26.58,31.5 26.07,31.86 23.48,31.86 22.42,32.44 22.07,32.79 21.92,38.12 21.7,38.79 21,39.48 18.87,39.48 18.15,39.58 17.62,40.11 17.32,41.52 17.23,41.69 16.93,41.99 16.74,42.01 16.14,42.01 13.64,42.44 13.49,42.47 11.18,43.24 8.8,44.04 8.17,44.3 6.26,45.24 5.33,45.79 4.08,45.79 2.04,47 JP2.1
N$27  (via drill 0.4 pad 0.6)
  Top 0.2: U1.22 43.35,31.73 43.26,31.73 43.01,31.73 v41.9,31.78
  Bottom 0.4: v41.9,31.78 42.88,31.78 43.4,31.27 47.49,26.68 47.56,26.52 47.56,25.3 46.99,19.46 45.7,15.27 45.7,14.09 45.66,12.74 45.66,12.54 45.64,10.2 45.64,9.12 47.76,2.8 JP1.19
N$28  (via drill 0.4 pad 0.6)
  Top 0.2: U1.21 43.35,31.23 43.26,31.23 43.09,31.23 43.06,31.21 42.85,31 v42.36,30.9
  Bottom 0.4: v42.36,30.9 46.76,26.28 46.76,25.54 46.43,22.11 46.19,19.62 44.97,15.41 44.97,14.24 44.89,12.89 44.89,12.7 44.84,10.36 44.84,8.96 45.22,2.8 JP1.18
N$29  (1 unrouted)
  Top 0.2: 44.77,30.37 44.67,30.57 44.88,30.52 | U1.20 44.16,30.73 44.26,30.73 44.46,30.73 44.86,30.42
  Top 0.4: 44.86,30.42 45.24,30.04 45.24,29.78 45.24,29.64 45.3,29.47 45.57,29.19 46.47,28.29 46.64,27.88 46.74,26.27 46.74,25.55 46.66,25.47 46.66,25.23 46.66,25.03 R8.2
N$30  (via drill 0.4 pad 0.6)  (1 unrouted)
  Top 0.2: 45.1,26.51 45.3,26.61 45.25,26.39 | U1.16 44.16,28.73 44.26,28.73 44.32,28.73 44.42,28.73 44.65,28.49 45.35,27.69 45.35,27.59 45.35,26.67 45.15,26.42
  Top 0.3: 45.15,26.42 45.13,26.25 45.11,26.22 45.11,25.6 45.25,24.63
  Top 0.4: 45.25,24.63 45.25,23.73 45.3,23.42 45.3,22.34 45.28,22.22 45.28,21.84 45.39,21 45.39,19.78 45.39,16.44 45.33,16.25 45.19,15.93 44.21,14.95 v42.46,13.45
  Bottom 0.4: v42.46,13.45 35.06,2.8 JP1.14
N$31  (via drill 0.4 pad 0.6)  (2 unrouted)
  Top 0.2: 42.68,27.42 42.65,27.21 | 42.66,26.88 42.65,27.18 42.76,27.94 43.05,28.23 43.26,28.23 43.35,28.23 U1.15
  Top 0.3: 42.66,26.88 42.95,26.48 43.22,25.59 43.34,25.06 43.34,24.44 43.32,23.36
  Top 0.4: 43.32,23.36 43.31,21.93 42.71,21.08 v43.79,20.19
  Bottom 0.4: v43.79,20.19 42.78,15.81 42.78,14.77 42.29,14.28 42.12,14.28 41.63,13.79 32.52,2.8 JP1.13
N$32  (via drill 0.4 pad 0.6)
  Top 0.2: 44.48,26.7 44.38,26.6 | 44.48,26.7 44.54,26.57 | U1.14 44.16,27.73 44.26,27.73 44.46,27.73 44.76,27.44 44.76,27.02 44.72,26.94 44.48,26.7 | 44.48,26.7 44.45,26.53
  Top 0.3: 44.62,22.49 44.59,16.6
  Top 0.4: 44.45,26.53 44.45,26.13 44.45,25.39 44.45,25.36 44.55,24.49 44.55,23.44 44.67,23.18 44.67,22.57 44.62,22.49 | 44.59,16.6 44.55,16.41 44.53,16.37 43.77,15.61 43.73,15.59 v41.95,15.11
  Bottom 0.4: v41.95,15.11 41.86,15.11 41.71,15.05 40.86,14.2 29.98,2.8 JP1.12
N$33  (via drill 0.4 pad 0.6)
  Top 0.2: U1.13 43.75,27.13 43.75,26.24 43.9,25.81 43.9,25.25 43.96,24.33 43.96,23.16 43.95,22.96 v43.88,21.28
  Bottom 0.4: v43.88,21.28 42.99,20.66 42.79,20.13 42.72,19.97 27.44,2.8 JP1.11
N$34  (via drill 0.4 pad 0.6)
  Top 0.2: U1.12 42.26,25.33 42.25,25.18 42.24,25.07 42.3,24.95 v42.59,24.7
  Bottom 0.4: v42.59,24.7 42.59,23.93 41.99,21 41.99,20.37 24.9,2.8 JP1.10
N$35  (via drill 0.4 pad 0.6)
  Top 0.2: U1.11 41.76,25.33 41.76,25.23 41.76,25.02 41.73,24.48 41.75,24.15 42.22,24.15 42.28,23.59 42.33,23.15 42.3,22.96 42.34,22.79 42.34,22.06 42.33,21.99 42.37,21.7 41.62,20.95 41.6,20.95 v41.09,20.74
  Bottom 0.4: v41.09,20.74 39.03,18.64 38.17,17.78 22.36,2.8 JP1.9
N$36  (via drill 0.4 pad 0.6)
  Top 0.2: U1.10 41.26,26.13 41.26,26.23 41.26,26.44 v41.51,26.92
  Bottom 0.4: v41.51,26.92 41.76,24.88 41.76,24.18 39.11,20.13 38.3,19.04 37.77,18.51 19.82,2.8 JP1.8
N$38  (1 unrouted)
  Top 0.2: 36.47,23.5 36.69,23.48 36.53,23.33 | U1.4 38.26,25.33 38.26,25.23 38.26,24.68 38.23,24.63 37.46,23.85 37.41,23.83 36.92,23.65 36.77,23.51 36.76,23.5 36.46,23.4
  Top 0.4: 36.46,23.4 36.12,23.13 33.98,22.37 24.65,19.71 24.17,19.71 24.11,19.69 23.91,19.55 23.57,19.41 20.46,18.85 19.45,18.84 19.03,18.84 18.68,18.49 18.64,18.42 18.64,17.96 18.63,17.92 18.59,17.84 18.56,17.78 18.48,17.39 18.47,17.19 18.47,15.29 18.47,14.8 18.81,13.62 18.86,13.36 18.86,11.04 18.81,10.78 18.32,9.6 14.74,2.8 JP1.6
N$39  (3 unrouted)
  Top 0.2: 17.58,16.69 17.72,16.86 17.76,16.65 | 20.12,19.55 19.9,19.57 20.06,19.72 | 35.79,24.03 36.01,24.03 35.87,23.86 | 17.66,16.63 17.76,17.04 17.77,17.48 17.97,18.03 18.11,18.17 18.11,18.73 18.79,19.41 19.84,19.55 20.13,19.65 | U1.3 37.76,25.33 37.76,25.23 37.76,24.82 37.17,24.23 37.08,24.21 36.69,24.21 36.52,24.1 36.17,24.1 35.79,23.93
  Top 0.4: 35.79,23.93 33.82,23.17 25.21,20.7 24.51,20.41 24.03,20.41 23.41,20.21 20.13,19.65 | 17.66,16.63 17.67,14.49 18.04,13.39 18.06,13.28 18.06,11.12 18.04,11.01 17.61,9.98 17.55,9.88 12.2,2.8 JP1.5
N$40  (2 unrouted)
  Top 0.2: 17,17.41 17.18,17.54 17.16,17.32 | 19.55,20.15 19.33,20.15 19.47,20.32 | 36.47,24.77 36.28,24.88 | 36.47,24.77 36.26,24.7 | 17.06,17.33 17.64,18.28 17.67,18.35 17.67,18.83 17.72,18.96 18.56,19.79 19.55,20.25 | U1.2 37.26,25.33 37.26,25.23 37.26,25.06 37.02,24.83 36.95,24.77 36.56,24.77 36.47,24.77 | 36.47,24.77 36.23,24.8
  Top 0.4: 36.23,24.8 35.91,24.8 35.46,24.73 33.52,23.97 25.05,21.49 24.42,21.23 24.17,21.11 23.89,21.11 19.8,20.45 19.55,20.25 | 17.06,17.33 16.86,16.96 16.86,16.3 16.87,14.34 17.26,13.18 17.26,11.22 16.91,10.38 13.23,6.13 12.07,4.97 9.66,2.8 JP1.4
N$41  (via drill 0.4 pad 0.6)
  Top 0.2: U1.19 43.35,30.23 43.26,30.23 43.05,30.23 42.8,30.22 42.24,30.22 v41.06,30.39
  Top 0.4: LED1.A 25.71,18.21 25.91,18.21 v26.6,18.21 26.8,16.4 26.82,16.35 28.91,12.12 29.68,11.34 40.72,4.15 42.68,2.8 JP1.17
  Bottom 0.4: v41.06,30.39 36.56,34.19 35.82,34.19 35.29,33.66 v26.6,18.21
N$42
  Top 0.4: R6.2 20.37,17.75 20.57,17.75 22.61,17.75 22.82,17.75 LED1.C
OSC_IN  (1 unrouted)
  Top 0.2: 37.17,23.09 37.38,23.14 37.28,22.95 | U1.5 38.76,25.33 38.76,25.23 38.76,24.58 38.66,24.35 37.74,23.43 37.19,22.99
  Top 0.4: 37.19,22.99 37.15,22.95 36.79,22.6 35.23,21.37 34.7,20.84 33.34,18.96 33.34,18.88 33.34,18.68 Q1.2 30.9,17.15 30.9,16.95 30.9,14.22 30.9,14.02 C2.1
OSC_OUT  (via drill 0.4 pad 0.6)
  Top 0.2: U1.6 39.26,26.13 39.26,26.23 39.26,26.44 38.96,26.73 v38.5,26.88
  Top 0.4: v37.48,20.9 38.24,19.76 38.24,18.88 38.24,18.68 Q1.1 39.16,17.15 39.16,16.95 39.16,13.97 38.81,13.62 38.56,13.62 38.37,13.62 C1.1
  Bottom 0.4: v38.5,26.88 v37.48,20.9
RESET  (via drill 0.4 pad 0.6)
  Top 0.2: U1.7 39.76,26.13 39.76,26.23 39.76,26.69 39.3,27.21 38.83,27.68 38.17,27.68 v36.21,26.68
  Top 0.4: 24.43,9.89 24.53,13.11 24.53,13.36 24.53,13.55 C15.1 | 24.43,9.89 25.33,9.89 25.53,9.89 S1.2 | JP1.7 17.28,2.8 24.43,9.89
  Bottom 0.4: v36.21,26.68 35.85,26.05 17.28,2.8 JP1.7
USBDM  (via drill 0.4 pad 0.6)  (1 unrouted)
  Top 0.2: 39.58,39.84 39.46,39.65 39.39,39.86 | U1.32 38.76,34.63 38.76,34.73 38.76,35.32 38.81,35.44 38.85,35.49 38.91,35.62 39.17,36.41 39.4,37.81 39.4,38.39 39.38,38.52 39.38,39.1 39.49,39.89
  Top 0.4: 39.49,39.89 39.49,40.96 39.35,41.31 38.35,42.31 31.94,45.65 29.98,47 JP2.12 | R5.2 23.76,22.91 23.96,22.91 24.47,22.91 24.56,22.97 25.34,23.75 25.36,23.8 v25.5,27.71
  Bottom 0.4: v25.5,27.71 26.05,32.77 29.98,47 JP2.12
USBDP  (via drill 0.4 pad 0.6)  (1 unrouted)
  Top 0.2: 38.79,38.05 38.68,37.86 38.61,38.07 | U1.33 38.26,34.63 38.26,34.73 38.26,35.42 38.58,36.65 38.7,38.1
  Top 0.4: 38.7,38.1 38.69,38.26 38.69,39.36 38.69,39.37 38.69,39.71 38.69,40.8 38.67,40.85 37.89,41.63 29.4,45.65 27.44,47 JP2.11 | R4.2 23.7,25.45 23.7,25.65 v23.7,27.87
  Bottom 0.4: v23.7,27.87 27.44,47 JP2.11

### Text on the board
tPlace: Gnd | 3V3 | Vin | Vin | 3V3 | Gnd | Order: 45427
bPlace: PB8 * | BOOT0 | PB7 * | PB6 * | PB5 | PB4 * | TRACESWO / PB3 * | PA15 * | SWCLK / PA14 * | SWDIO / PA13 * | USB+ / CAN TX / PA12 * | USB- / CAN RX / PA11 * | PA10 * | PA9 * | PA8 * | PB15 * | PB14* | PB13* | PB12* | GND | 3V3 | Vin | Vin | 3V3 | GND | RESET | *PB10 | *PB11 | 3V3 | pc13 | pc14 | pc15 | PA0 | PA1 | PA2 | PA3 | PA4 | PA5 | PA6 | PA7 | PB0 | PB1 | Vin | GND